# Altium project ammdk_shield.PrjPcb
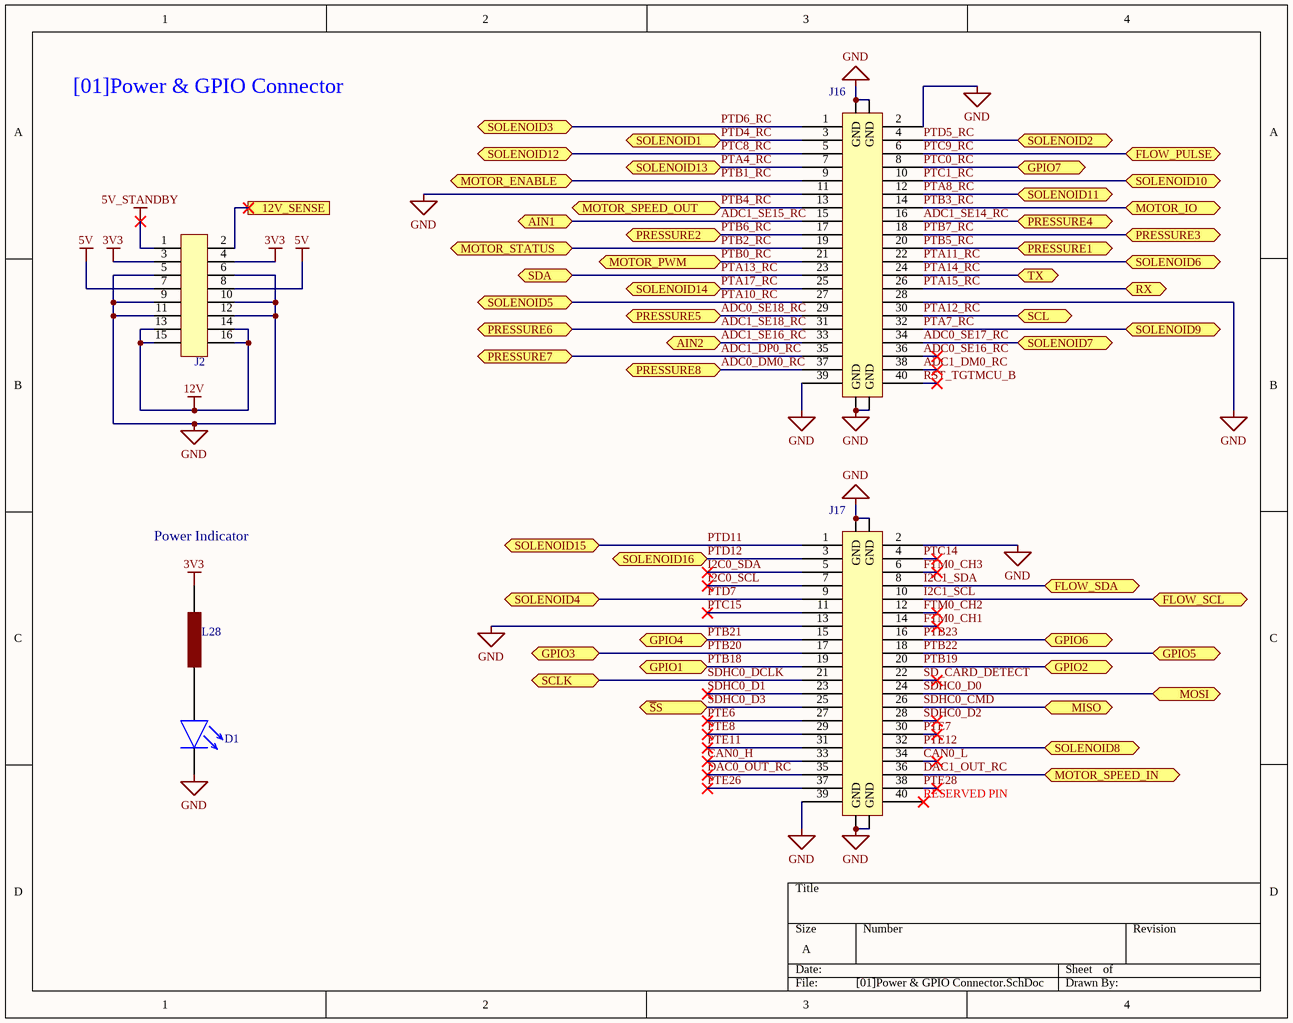
[diagram p0: [01]Power & GPIO Connector.SchDoc]
5 sheets, 112 parts. Net scope: flat (ports and power ports of the same name join across sheets).
Board files: blank_application_board.PcbDoc, generic_shield.PcbDoc
Sheets:
  [01]Power & GPIO Connector.SchDoc
  [02]Solenoid Driver.SchDoc
  [03]Pressure and Flow.SchDoc
  [04]Misc IO.SchDoc
  [05]Motor.SchDoc

## Sheet [01]Power & GPIO Connector.SchDoc
size A

### Parts
D1  XZFBB45S-9  [PLCC-2]  (value not drawn)
J2  DF11-16DP-2DSA(01)  [DF11-16DP-2DSA(01)_FLIP]  (value not drawn)
J16  M55-7004042R  [M55-7004042R_FLIP]  (value not drawn)
J17  M55-7004042R  [M55-7004042R_FLIP]  (value not drawn)
L28  MH2029-300Y  [INDC2012X11N]  (value not drawn)

### Ports
12V_SENSE, AIN1 (bidir), AIN2 (bidir), FLOW_PULSE (bidir), FLOW_SCL (bidir), FLOW_SDA (bidir), GPIO1 (bidir), GPIO2 (bidir), GPIO3 (bidir), GPIO4 (bidir), GPIO5 (bidir), GPIO6 (bidir), GPIO7 (bidir), MISO (bidir), MOSI (bidir), MOTOR_ENABLE (bidir), MOTOR_IO (bidir), MOTOR_PWM (bidir), MOTOR_SPEED_IN (bidir), MOTOR_SPEED_OUT (bidir), MOTOR_STATUS (bidir), PRESSURE1 (bidir), PRESSURE2 (bidir), PRESSURE3 (bidir), PRESSURE4 (bidir), PRESSURE5 (bidir), PRESSURE6 (bidir), PRESSURE7 (bidir), PRESSURE8 (bidir), RX (bidir), SCL (bidir), SCLK (bidir), SDA (bidir), SOLENOID1 (bidir), SOLENOID2 (bidir), SOLENOID3 (bidir), SOLENOID4 (bidir), SOLENOID5 (bidir), SOLENOID6 (bidir), SOLENOID7 (bidir), SOLENOID8 (bidir), SOLENOID9 (bidir), SOLENOID10 (bidir), SOLENOID11 (bidir), SOLENOID12 (bidir), SOLENOID13 (bidir), SOLENOID14 (bidir), SOLENOID15 (bidir), SOLENOID16 (bidir), TX (bidir), ~{S}S (bidir)

### Nets
3V3: J2.3 J2.4 L28.2
5V: J2.7 J2.8
5V_STANDBY: J2.1
12V: J2.13 J2.14 J2.15 J2.16
GND: D1.2 J2.5 J2.6 J2.9 J2.10 J2.11 J2.12 J16.2 J16.11 J16.28 J16.39 J16.GND J17.2 J17.13 J17.39 J17.GND
ADC0_DM0_RC: J16.37 ; port PRESSURE8
ADC0_SE16_RC: J16.36
ADC0_SE17_RC: J16.34 ; port SOLENOID7
ADC0_SE18_RC: J16.29 ; port PRESSURE5
ADC1_DM0_RC: J16.38
ADC1_DP0_RC: J16.35 ; port PRESSURE7
ADC1_SE14_RC: J16.16 ; port PRESSURE4
ADC1_SE15_RC: J16.15 ; port AIN1
ADC1_SE16_RC: J16.33 ; port AIN2
ADC1_SE18_RC: J16.31 ; port PRESSURE6
CAN0_H: J17.33
CAN0_L: J17.34
DAC0_OUT_RC: J17.35
DAC1_OUT_RC: J17.36 ; port MOTOR_SPEED_IN
FTM0_CH1: J17.14
FTM0_CH2: J17.12
FTM0_CH3: J17.6
I2C0_SCL: J17.7
I2C0_SDA: J17.5
I2C1_SCL: J17.10 ; port FLOW_SCL
I2C1_SDA: J17.8 ; port FLOW_SDA
PTA4_RC: J16.7 ; port SOLENOID13
PTA7_RC: J16.32 ; port SOLENOID9
PTA8_RC: J16.12 ; port SOLENOID11
PTA10_RC: J16.27 ; port SOLENOID5
PTA11_RC: J16.22 ; port SOLENOID6
PTA12_RC: J16.30 ; port SCL
PTA13_RC: J16.23 ; port SDA
PTA14_RC: J16.24 ; port TX
PTA15_RC: J16.26 ; port RX
PTA17_RC: J16.25 ; port SOLENOID14
PTB0_RC: J16.21 ; port MOTOR_PWM
PTB1_RC: J16.9 ; port MOTOR_ENABLE
PTB2_RC: J16.19 ; port MOTOR_STATUS
PTB3_RC: J16.14 ; port MOTOR_IO
PTB4_RC: J16.13 ; port MOTOR_SPEED_OUT
PTB5_RC: J16.20 ; port PRESSURE1
PTB6_RC: J16.17 ; port PRESSURE2
PTB7_RC: J16.18 ; port PRESSURE3
PTB18: J17.19 ; port GPIO1
PTB19: J17.20 ; port GPIO2
PTB20: J17.17 ; port GPIO3
PTB21: J17.15 ; port GPIO4
PTB22: J17.18 ; port GPIO5
PTB23: J17.16 ; port GPIO6
PTC0_RC: J16.8 ; port GPIO7
PTC1_RC: J16.10 ; port SOLENOID10
PTC8_RC: J16.5 ; port SOLENOID12
PTC9_RC: J16.6 ; port FLOW_PULSE
PTC14: J17.4
PTC15: J17.11
PTD4_RC: J16.3 ; port SOLENOID1
PTD5_RC: J16.4 ; port SOLENOID2
PTD6_RC: J16.1 ; port SOLENOID3
PTD7: J17.9 ; port SOLENOID4
PTD11: J17.1 ; port SOLENOID15
PTD12: J17.3 ; port SOLENOID16
PTE6: J17.27
PTE7: J17.30
PTE8: J17.29
PTE11: J17.31
PTE12: J17.32 ; port SOLENOID8
PTE26: J17.37
PTE28: J17.38
RST_TGTMCU_B: J16.40
SD_CARD_DETECT: J17.22
SDHC0_CMD: J17.26 ; port MISO
SDHC0_D0: J17.24 ; port MOSI
SDHC0_D1: J17.23
SDHC0_D2: J17.28
SDHC0_D3: J17.25 ; port ~{S}S
SDHC0_DCLK: J17.21 ; port SCLK
NetD1_1: D1.1 L28.1
NetJ2_2: J2.2 ; port 12V_SENSE

Not connected (* = marked no-connect by the designer): J17 40*

### Notes on the sheet
- [01]Power & GPIO Connector
- Power Indicator
- (near J17) RESERVED PIN

### Library data of the parts
D1 = XZFBB45S-9: LED BLUE CLEAR 2PLCC SMD; Manufacturer: SunLED; Configuration: Standard; Lens Color: Colorless; Millicandela Rating: 447mcd; Lens Style: Round with Flat Top; Lens Size: 2.40mm Dia; Voltage - Forward (Vf) (Typ): 3.3V; Current - Test: 20mA; Viewing Angle: 120°; Wavelength - Dominant: 470nm; Wavelength - Peak: 465nm; Supplier 1: Digi-Key; Manufacturer Part Number: XZFBB45S-9; RoHS: RoHS Compliant; Category: Optoelectronics; Stock 1: 5275; Pricing 1: 1=0.83, 10=0.651, 25=0.5456, 100=0.4752, 250=0.4224, 500=0.3696, 1000=0.2992 (USD); Packaging: Cut Tape (CT); Part Status: Active; Color: Blue; Lens Transparency: Clear; Mounting Type: Surface Mount, Bottom Entry; Features: -; Package / Case: 2-SMD, Z-Bend; Supplier Device Package: 2-PLCC; Size / Dimension: 3.20mm L x 2.80mm W; Height (Max): 1.90mm; ComponentLink1URL: http://www.sunledusa.com/products/spec/XZFBB45S-9.pdf; ComponentLink1Description: http://www.sunledusa.com/products/spec/XZFBB45S-9.pdf; Supplier Part Number 1: 1497-1233-1-ND
J2 = DF11-16DP-2DSA(01): Headers & Wire Housings 2MM V PCB HEADER 16P DR THRU-HOLE GLD; Manufacturer: Hirose Connector; Current Rating: 2 A; Mounting Angle: Vertical; Number of Positions: 16 Position; Voltage Rating: 250 V; Supplier 1: Digi-Key; Manufacturer Part Number: DF11-16DP-2DSA(01); RoHS: RoHS Compliant; Category: Headers & Wire Housings; Contact Plating: Gold; Number of Rows: 2 Row; Packaging: Bulk; Product: Headers; Series: DF11; Termination Style: Through Hole; Type: Shrouded; Brand: Hirose Connector; Contact Material: Brass; Mounting Style: -; Pitch: 2 mm; Standard Pack Qty: 100; RoHS - Mouser: Y; Minimum Order Quantity: 1; Reeling: False; ComponentLink1URL: http://www.mouser.com/datasheet/2/185/DF11_catalog-939040.pdf; ComponentLink1Description: http://www.mouser.com/datasheet/2/185/DF11_catalog-939040.pdf; Supplier Part Number 1: H2856-ND
J16 J17 = M55-7004042R: Board to Board & Mezzanine Connectors 40P 1.27 SMC Male; Manufacturer: Harwin; Current Rating: 1.2 A; Mounting Angle: Straight; Number of Positions: 40 Position; Voltage Rating: 100 V; Pitch: 1.27 mm; Insulation Resistance: 10 GOhms; Stack Height: 6.75 mm; Product Status: New Product; Supplier 1: Digi-Key; Manufacturer Part Number: M55-7004042R; RoHS: RoHS Compliant; Category: Board to Board & Mezzanine Connectors; Contact Plating: Gold; Housing Material: Liquid Crystal Polymer (LCP); Number of Rows: 2 Row; Packaging: Cut Tape; Product: Headers; Termination Style: SMD/SMT; Brand: Harwin; Contact Material: Phosphor Bronze; Flammability Rating: UL 94 V-0; Mounting Style: Mounting Peg; Maximum Operating Temperature: + 125 C; Minimum Operating Temperature: - 55 C; Standard Pack Qty: 500; Termination Post Length: 4 mm; Tradename: Archer Kontrol; RoHS - Mouser: Y; Minimum Order Quantity: 1; Reeling: True; ComponentLink1URL: http://www.mouser.com/datasheet/2/181/M55-70X-1286676.pdf; ComponentLink1Description: http://www.mouser.com/datasheet/2/181/M55-70X-1286676.pdf; Supplier Part Number 1: 952-3871-1-ND
L28 = MH2029-300Y: EMI Filter Beads, Chips & Arrays Impedance 30ohms IDC 3.0; Manufacturer: Bourns; Maximum DC Current: 3 A; Maximum DC Resistance: 25 mOhms; Tolerance: 25 %; Type: High Current Chip Ferrite Bead; Test Frequency: 100 MHz; Filter Type: Power, Signal Line; Number of Lines: 1; Impedance @ Frequency: 30 Ohm @ 100MHz; Current Rating (Max): 3A; DC Resistance (DCR) (Max): 25 mOhm; Manufacturer Part Number: MH2029-300Y; RoHS: RoHS Compliant; Category: EMI Filter Beads, Chips & Arrays; Pricing 1: 1=0.1, 10=0.062, 25=0.0568, 50=0.051, 100=0.0375, 250=0.02724, 500=0.02498, 1000=0.02157 (USD); Capacitance: -; Height: 0.9 mm; Impedance: 30 Ohms; Length: 2 mm; Operating Temperature Range: - 55 C to + 125 C; Package / Case: 0805 (2012 metric); Packaging: Reel; Product: Ferrite Chip Beads; Termination Style: SMD/SMT; Width: 1.2 mm; Brand: Bourns; Product Category: SMD Ferrite Bead; Standard Pack Qty: 4000; RoHS - Mouser: Y; Minimum Order Quantity: 1; Reeling: True; ComponentLink1URL: http://www.mouser.com/ds/2/54/h-777565.pdf; ComponentLink1Description: http://www.mouser.com/ds/2/54/h-777565.pdf; Supplier 1: Digi-Key; Stock 1: 62738; Ratings: -; Operating Temperature: -55°C ~ 125°C; Mounting Type: Surface Mount; Height (Max): 0.043" (1.10mm); Size / Dimension: 0.079" L x 0.047" W (2.00mm x 1.20mm); ComponentLink2URL: http://www.bourns.com/docs/Product-Datasheets/mh.pdf; ComponentLink2Description: http://www.bourns.com/docs/Product-Datasheets/mh.pdf; Supplier Part Number 1: MH2029-300YCT-ND

## Sheet [02]Solenoid Driver.SchDoc
size A3
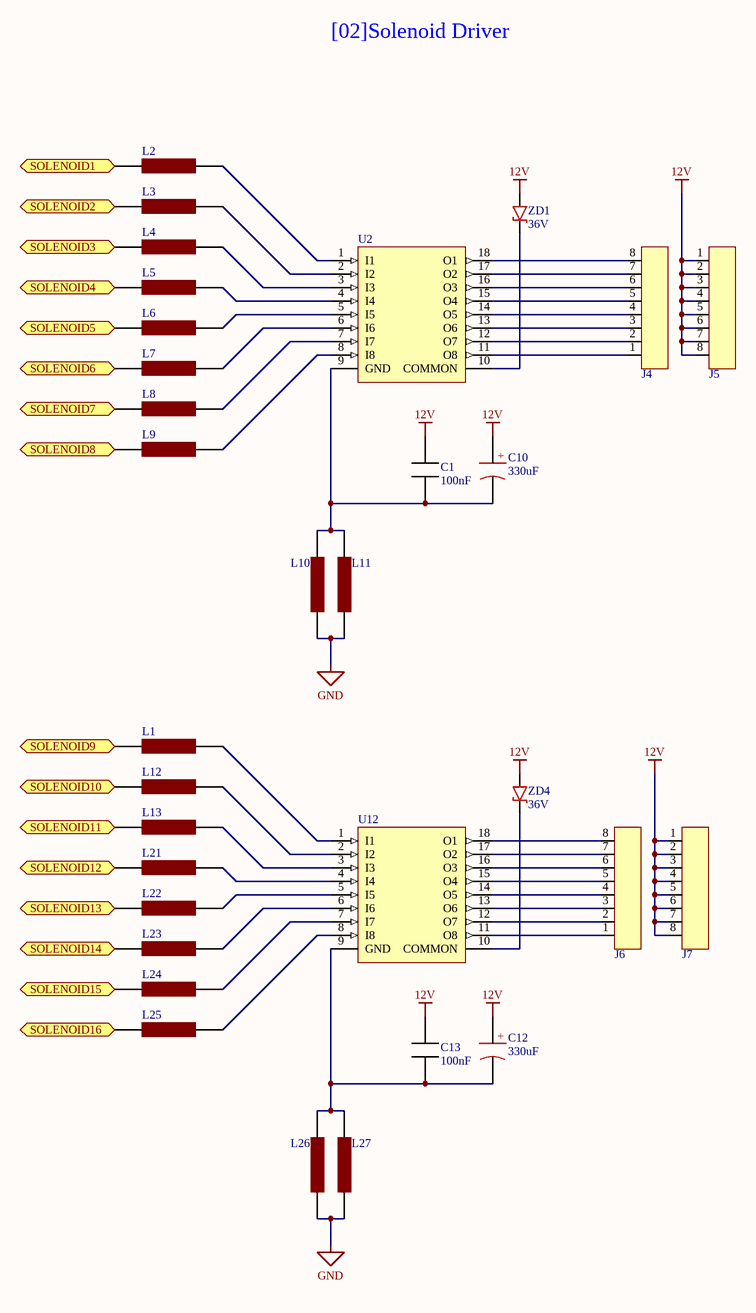
[diagram p1: [02]Solenoid Driver.SchDoc]

### Parts
C1  100nF  [CAPC2012X09N]
C10  330uF  [CAPAE137130X140M]
C12  330uF  [CAPAE137130X140M]
C13  100nF  [CAPC2012X09N]
J4  1771156  [1771156]  (value not drawn)
J5  1771156  [1771156]  (value not drawn)
J6  1771156  [1771156]  (value not drawn)
J7  1771156  [1771156]  (value not drawn)
L1  MH2029-300Y  [INDC2012X11N]  (value not drawn)
L2  MH2029-300Y  [INDC2012X11N]  (value not drawn)
L3  MH2029-300Y  [INDC2012X11N]  (value not drawn)
L4  MH2029-300Y  [INDC2012X11N]  (value not drawn)
L5  MH2029-300Y  [INDC2012X11N]  (value not drawn)
L6  MH2029-300Y  [INDC2012X11N]  (value not drawn)
L7  MH2029-300Y  [INDC2012X11N]  (value not drawn)
L8  MH2029-300Y  [INDC2012X11N]  (value not drawn)
L9  MH2029-300Y  [INDC2012X11N]  (value not drawn)
L10  MH2029-300Y  [INDC2012X11N]  (value not drawn)
L11  MH2029-300Y  [INDC2012X11N]  (value not drawn)
L12  MH2029-300Y  [INDC2012X11N]  (value not drawn)
L13  MH2029-300Y  [INDC2012X11N]  (value not drawn)
L21  MH2029-300Y  [INDC2012X11N]  (value not drawn)
L22  MH2029-300Y  [INDC2012X11N]  (value not drawn)
L23  MH2029-300Y  [INDC2012X11N]  (value not drawn)
L24  MH2029-300Y  [INDC2012X11N]  (value not drawn)
L25  MH2029-300Y  [INDC2012X11N]  (value not drawn)
L26  MH2029-300Y  [INDC2012X11N]  (value not drawn)
L27  MH2029-300Y  [INDC2012X11N]  (value not drawn)
U2  TBD62083A  [TSOP65P640X155-18N]  (value not drawn)
U12  TBD62083A  [TSOP65P640X155-18N]  (value not drawn)
ZD1  36V  [SOT95P237X111-3N]
ZD4  36V  [SOT95P237X111-3N]

### Ports
SOLENOID1 (bidir), SOLENOID2 (bidir), SOLENOID3 (bidir), SOLENOID4 (bidir), SOLENOID5 (bidir), SOLENOID6 (bidir), SOLENOID7 (bidir), SOLENOID8 (bidir), SOLENOID9 (bidir), SOLENOID10 (bidir), SOLENOID11 (bidir), SOLENOID12 (bidir), SOLENOID13 (bidir), SOLENOID14 (bidir), SOLENOID15 (bidir), SOLENOID16 (bidir)

### Nets
12V: C1.2 C10.1 C12.1 C13.2 J5.1 J5.2 J5.3 J5.4 J5.5 J5.6 J5.7 J5.8 J7.1 J7.2 J7.3 J7.4 J7.5 J7.6 J7.7 J7.8 ZD1.A ZD4.A
GND: L10.1 L11.1 L26.1 L27.1
ADC0_SE17_RC: L8.1 ; port SOLENOID7
PTA4_RC: L22.1 ; port SOLENOID13
PTA7_RC: L1.1 ; port SOLENOID9
PTA8_RC: L13.1 ; port SOLENOID11
PTA10_RC: L6.1 ; port SOLENOID5
PTA11_RC: L7.1 ; port SOLENOID6
PTA17_RC: L23.1 ; port SOLENOID14
PTC1_RC: L12.1 ; port SOLENOID10
PTC8_RC: L21.1 ; port SOLENOID12
PTD4_RC: L2.1 ; port SOLENOID1
PTD5_RC: L3.1 ; port SOLENOID2
PTD6_RC: L4.1 ; port SOLENOID3
PTD7: L5.1 ; port SOLENOID4
PTD11: L24.1 ; port SOLENOID15
PTD12: L25.1 ; port SOLENOID16
PTE12: L9.1 ; port SOLENOID8
NetC1_1: C1.1 C10.2 L10.2 L11.2 U2.9(GND)
NetC12_2: C12.2 C13.1 L26.2 L27.2 U12.9(GND)
NetJ4_1: J4.1 U2.11(O8)
NetJ4_2: J4.2 U2.12(O7)
NetJ4_3: J4.3 U2.13(O6)
NetJ4_4: J4.4 U2.14(O5)
NetJ4_5: J4.5 U2.15(O4)
NetJ4_6: J4.6 U2.16(O3)
NetJ4_7: J4.7 U2.17(O2)
NetJ4_8: J4.8 U2.18(O1)
NetJ6_1: J6.1 U12.11(O8)
NetJ6_2: J6.2 U12.12(O7)
NetJ6_3: J6.3 U12.13(O6)
NetJ6_4: J6.4 U12.14(O5)
NetJ6_5: J6.5 U12.15(O4)
NetJ6_6: J6.6 U12.16(O3)
NetJ6_7: J6.7 U12.17(O2)
NetJ6_8: J6.8 U12.18(O1)
NetL1_2: L1.2 U12.1(I1)
NetL2_2: L2.2 U2.1(I1)
NetL3_2: L3.2 U2.2(I2)
NetL4_2: L4.2 U2.3(I3)
NetL5_2: L5.2 U2.4(I4)
NetL6_2: L6.2 U2.5(I5)
NetL7_2: L7.2 U2.6(I6)
NetL8_2: L8.2 U2.7(I7)
NetL9_2: L9.2 U2.8(I8)
NetL12_2: L12.2 U12.2(I2)
NetL13_2: L13.2 U12.3(I3)
NetL21_2: L21.2 U12.4(I4)
NetL22_2: L22.2 U12.5(I5)
NetL23_2: L23.2 U12.6(I6)
NetL24_2: L24.2 U12.7(I7)
NetL25_2: L25.2 U12.8(I8)
NetU2_10: U2.10(COMMON) ZD1.K
NetU12_10: U12.10(COMMON) ZD4.K

### Notes on the sheet
- [02]Solenoid Driver
- (in symbol EMVH350ARA331MKE0S) +

### Library data of the parts
C1 C13 = CL21F104ZBCNNNC: CAP CER 0.1UF 50V Y5V 0805; Manufacturer: Samsung Electro-Mechanics America, Inc.; Capacitance: 0.10µF; Tolerance: -20%, +80%; Temperature Coefficient: Y5V (F); Supplier 1: Digi-Key; Manufacturer Part Number: CL21F104ZBCNNNC; RoHS: RoHS Compliant; Category: Capacitors; Stock 1: 1030146; Pricing 1: 1=0.1, 10=0.031, 25=0.022, 50=0.017, 100=0.0144, 500=0.01004, 1000=0.00783 (USD); Packaging: Cut Tape (CT); Voltage - Rated: 50V; Mounting Type: Surface Mount, MLCC; Operating Temperature: -30°C ~ 85°C; Applications: General Purpose; Ratings: -; Package / Case: 0805 (2012 Metric); Size / Dimension: 0.079" L x 0.049" W (2.00mm x 1.25mm); Height - Seated (Max): -; Thickness (Max): 0.037" (0.95mm); Lead Spacing: -; Features: -; Lead Style: -; ComponentLink1URL: http://www.samsungsem.com/kr/support/product-search/mlcc/CL21F104ZBCNNNC.jsp; ComponentLink1Description: http://www.samsungsem.com/kr/support/product-search/mlcc/CL21F104ZBCNNNC.jsp; Supplier Part Number 1: 1276-1007-1-ND
C10 C12 = EMVH350ARA331MKE0S: CAP ALUM 330UF 20% 35V SMD; Supplier 1: Digi-Key; Supplier Part Number 1: 565-2316-1-ND
J4-J7 = 1771156: CONN TERM BLK 8POS 2.5MM SMD; Manufacturer: Phoenix Contact; Positions Per Level: 8; Pitch: 0.098" (2.50mm); Mating Orientation: Vertical with Board; Wire Gauge: 20-26 AWG; Wire Termination: Screwless - Spring Cage, Tension Clamp; Supplier 1: Digi-Key; Manufacturer Part Number: 1771156; RoHS: RoHS Compliant; Category: Connectors, Interconnects; Stock 1: 2856; Pricing 1: 1=1.39, 10=1.334, 50=1.276, 100=1.2412 (USD); Packaging: Cut Tape (CT); Part Status: Active; Mounting Type: Surface Mount; Features: Solder Retention; Color: Black; Operating Temperature: -; Housing Material: Liquid Crystal Polymer (LCP); Contact Material - Plating: -; Clamp Material - Plating: -; Screw Material - Plating: -; Torque - Screw: -; Screw Thread: -; ComponentLink1URL: https://media.digikey.com/pdf/Data%20Sheets/Phoenix%20Contact%20PDFs/1771156.pdf; ComponentLink1Description: https://media.digikey.com/pdf/Data%20Sheets/Phoenix%20Contact%20PDFs/1771156.pdf; Supplier Part Number 1: 277-2078-1-ND
L1-L13 L21-L27 = MH2029-300Y: as L28 on sheet [01]Power & GPIO Connector; Manufacturer Part Number: MH2029-300Y; RoHS: RoHS Compliant; Category: EMI Filter Beads, Chips & Arrays; Pricing 1: 1=0.1, 10=0.062, 25=0.0568, 50=0.051, 100=0.0375, 250=0.02724, 500=0.02498, 1000=0.02157 (USD); Capacitance: -; Height: 0.9 mm; Impedance: 30 Ohms; Length: 2 mm; Operating Temperature Range: - 55 C to + 125 C; Package / Case: 0805 (2012 metric); Packaging: Reel; Product: Ferrite Chip Beads; Termination Style: SMD/SMT; Width: 1.2 mm; Brand: Bourns; Product Category: SMD Ferrite Bead; Standard Pack Qty: 4000; RoHS - Mouser: Y; Minimum Order Quantity: 1; Reeling: True; ComponentLink1URL: http://www.mouser.com/ds/2/54/h-777565.pdf; ComponentLink1Description: http://www.mouser.com/ds/2/54/h-777565.pdf; Supplier 1: Digi-Key; Stock 1: 62738; Ratings: -; Operating Temperature: -55°C ~ 125°C; Mounting Type: Surface Mount; Height (Max): 0.043" (1.10mm); Size / Dimension: 0.079" L x 0.047" W (2.00mm x 1.20mm); ComponentLink2URL: http://www.bourns.com/docs/Product-Datasheets/mh.pdf; ComponentLink2Description: http://www.bourns.com/docs/Product-Datasheets/mh.pdf; Supplier Part Number 1: MH2029-300YCT-ND
U2 U12 = TBD62083A: 8channel source type DMOS transistor array; Supplier 1: Digi-Key; Supplier Part Number 1: TBD62083AFNGELCT-ND
ZD1 ZD4 = BZX84C36LT1G: Zener Diode 36V 225mW ±6%; pin to pad: A>1 K>3; Supplier 1: Digi-Key; Supplier Part Number 1: BZX84C36LT1GOSCT-ND

## Sheet [03]Pressure and Flow.SchDoc
size A3
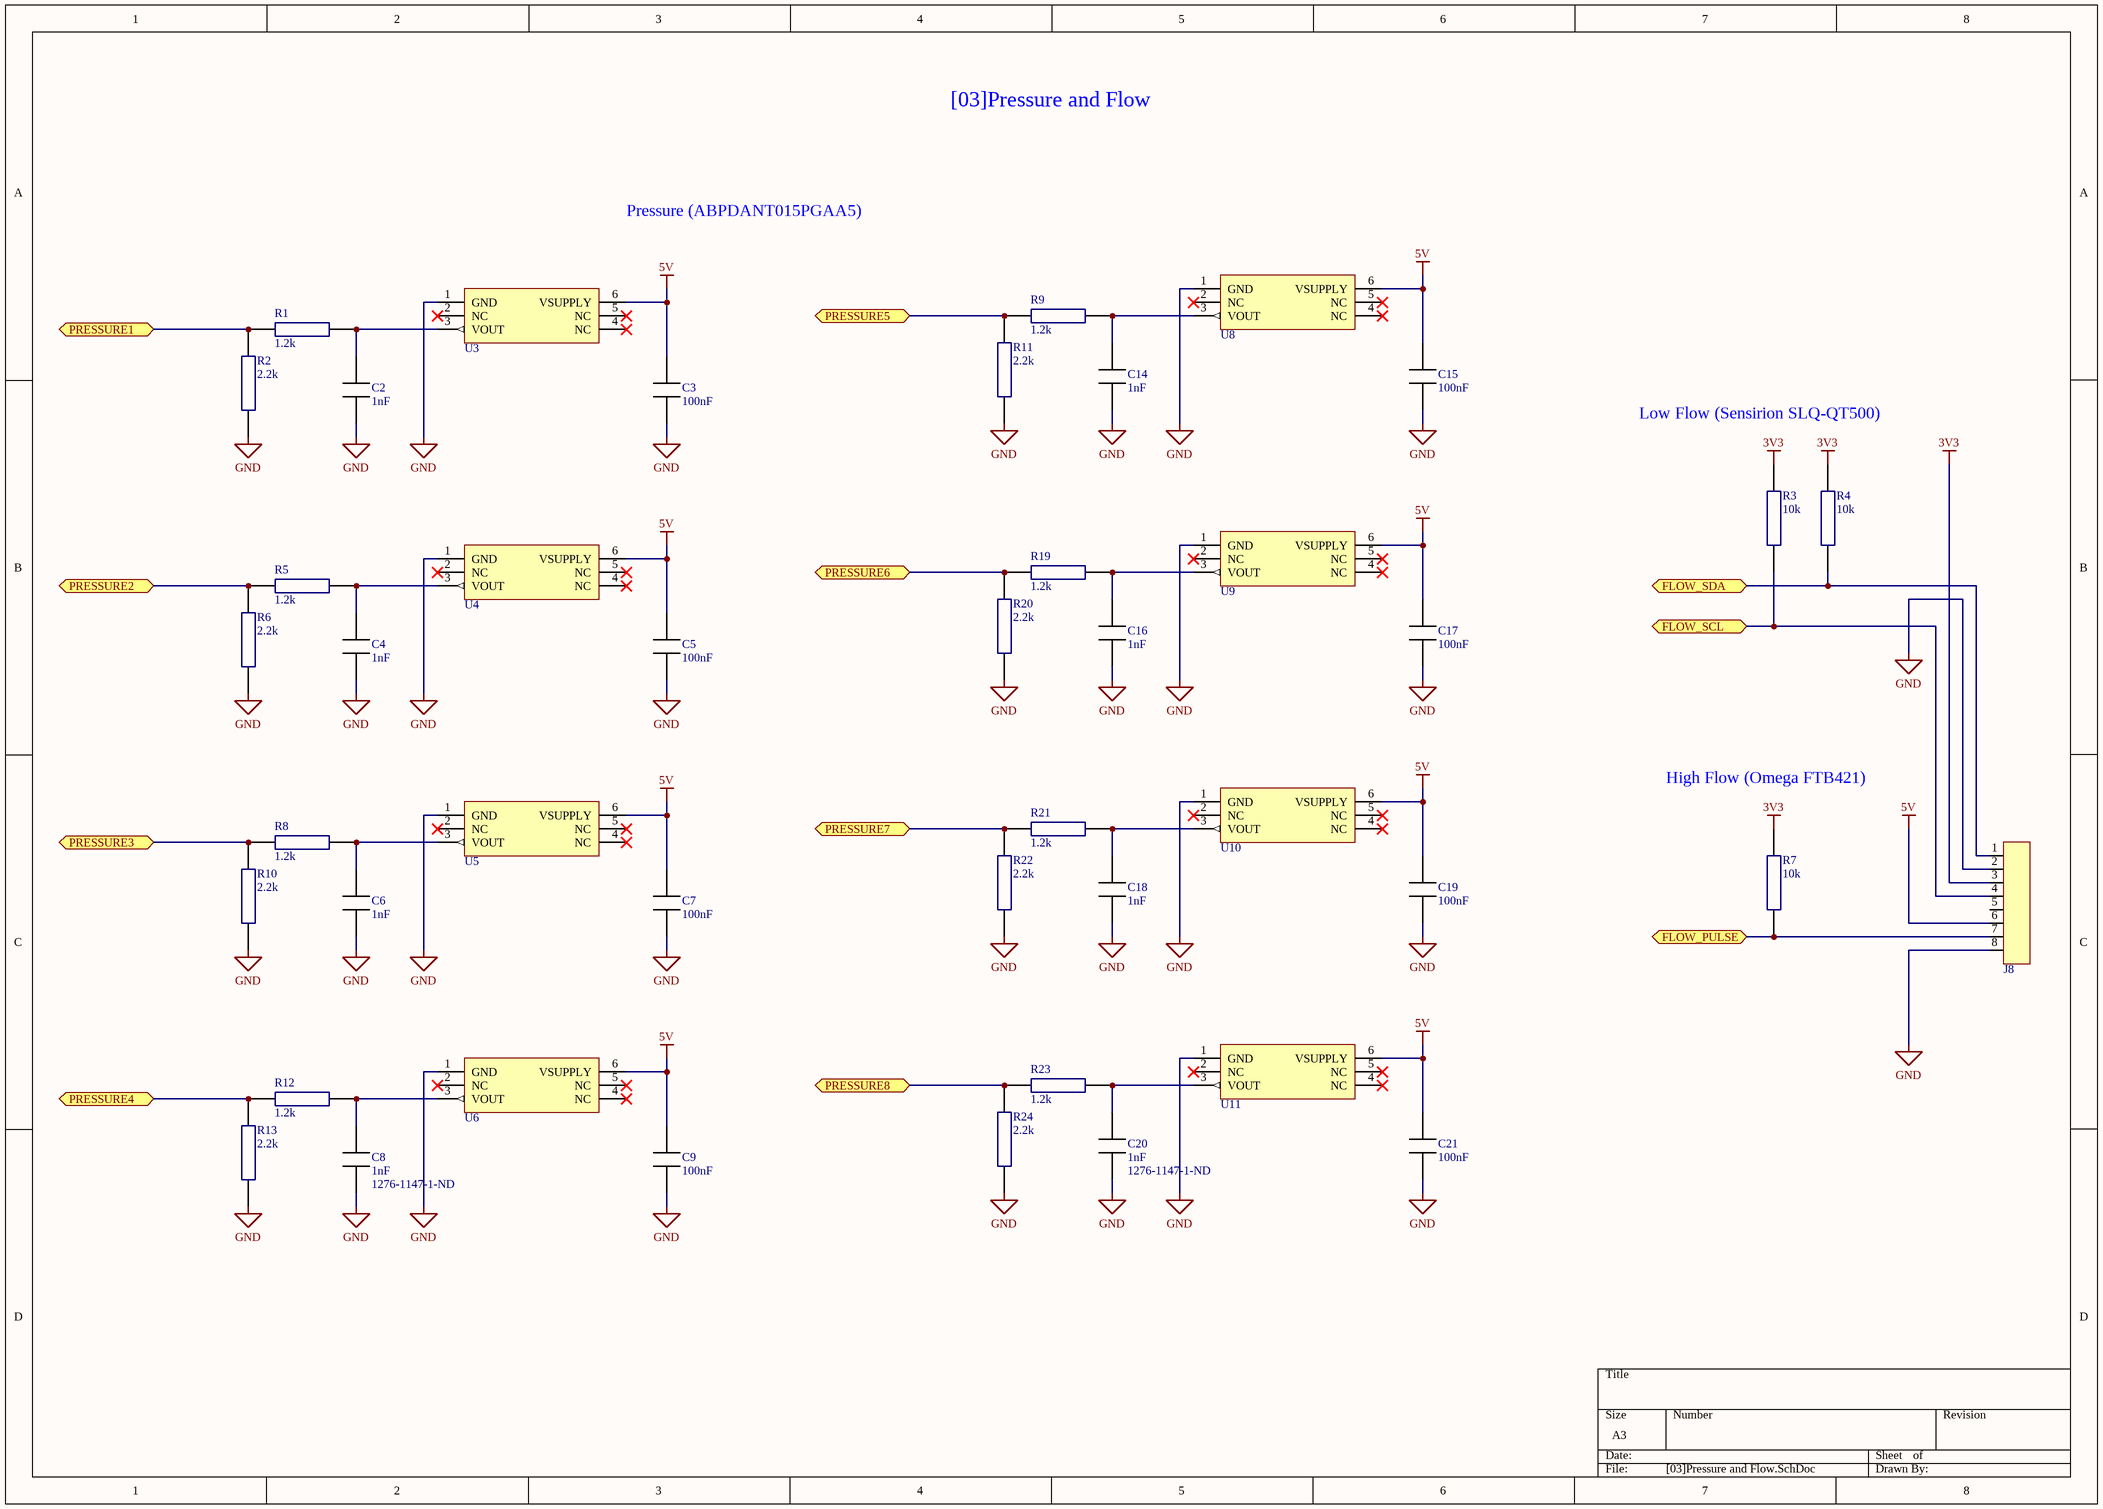
[diagram p2: [03]Pressure and Flow.SchDoc]

### Parts
C2  1nF  [CAPC2012X09N]
C3  100nF  [CAPC2012X09N]
C4  1nF  [CAPC2012X09N]
C5  100nF  [CAPC2012X09N]
C6  1nF  [CAPC2012X09N]
C7  100nF  [CAPC2012X09N]
C8  1nF  Supplier Part Number 1: 1276-1147-1-ND  [CAPC2012X09N]
C9  100nF  [CAPC2012X09N]
C14  1nF  [CAPC2012X09N]
C15  100nF  [CAPC2012X09N]
C16  1nF  [CAPC2012X09N]
C17  100nF  [CAPC2012X09N]
C18  1nF  [CAPC2012X09N]
C19  100nF  [CAPC2012X09N]
C20  1nF  Supplier Part Number 1: 1276-1147-1-ND  [CAPC2012X09N]
C21  100nF  [CAPC2012X09N]
J8  1771156  [1771156]  (value not drawn)
R1  1.2k  [RESC2012X07N_SAMSUNG]
R2  2.2k  [RESC2012X07N_SAMSUNG]
R3  10k  [RESC2012X07N_SAMSUNG]
R4  10k  [RESC2012X07N_SAMSUNG]
R5  1.2k  [RESC2012X07N_SAMSUNG]
R6  2.2k  [RESC2012X07N_SAMSUNG]
R7  10k  [RESC2012X07N_SAMSUNG]
R8  1.2k  [RESC2012X07N_SAMSUNG]
R9  1.2k  [RESC2012X07N_SAMSUNG]
R10  2.2k  [RESC2012X07N_SAMSUNG]
R11  2.2k  [RESC2012X07N_SAMSUNG]
R12  1.2k  [RESC2012X07N_SAMSUNG]
R13  2.2k  [RESC2012X07N_SAMSUNG]
R19  1.2k  [RESC2012X07N_SAMSUNG]
R20  2.2k  [RESC2012X07N_SAMSUNG]
R21  1.2k  [RESC2012X07N_SAMSUNG]
R22  2.2k  [RESC2012X07N_SAMSUNG]
R23  1.2k  [RESC2012X07N_SAMSUNG]
R24  2.2k  [RESC2012X07N_SAMSUNG]
U3  ABPDANT015PGAA5_SMD  [DIP6 SMD]  (value not drawn)
U4  ABPDANT015PGAA5_SMD  [DIP6 SMD]  (value not drawn)
U5  ABPDANT015PGAA5_SMD  [DIP6 SMD]  (value not drawn)
U6  ABPDANT015PGAA5_SMD  [DIP6 SMD]  (value not drawn)
U8  ABPDANT015PGAA5_SMD  [DIP6 SMD]  (value not drawn)
U9  ABPDANT015PGAA5_SMD  [DIP6 SMD]  (value not drawn)
U10  ABPDANT015PGAA5_SMD  [DIP6 SMD]  (value not drawn)
U11  ABPDANT015PGAA5_SMD  [DIP6 SMD]  (value not drawn)

### Ports
FLOW_PULSE (bidir), FLOW_SCL (bidir), FLOW_SDA (bidir), PRESSURE1 (bidir), PRESSURE2 (bidir), PRESSURE3 (bidir), PRESSURE4 (bidir), PRESSURE5 (bidir), PRESSURE6 (bidir), PRESSURE7 (bidir), PRESSURE8 (bidir)

### Nets
3V3: J8.3 R3.2 R4.2 R7.2
5V: C3.2 C5.2 C7.2 C9.2 C15.2 C17.2 C19.2 C21.2 J8.6 U3.6(VSUPPLY) U4.6(VSUPPLY) U5.6(VSUPPLY) U6.6(VSUPPLY) U8.6(VSUPPLY) U9.6(VSUPPLY) U10.6(VSUPPLY) U11.6(VSUPPLY)
GND: C2.1 C3.1 C4.1 C5.1 C6.1 C7.1 C8.1 C9.1 C14.1 C15.1 C16.1 C17.1 C18.1 C19.1 C20.1 C21.1 J8.2 J8.8 R2.1 R6.1 R10.1 R11.1 R13.1 R20.1 R22.1 R24.1 U3.1(GND) U4.1(GND) U5.1(GND) U6.1(GND) U8.1(GND) U9.1(GND) U10.1(GND) U11.1(GND)
ADC0_DM0_RC: R23.1 R24.2 ; port PRESSURE8
ADC0_SE18_RC: R9.1 R11.2 ; port PRESSURE5
ADC1_DP0_RC: R21.1 R22.2 ; port PRESSURE7
ADC1_SE14_RC: R12.1 R13.2 ; port PRESSURE4
ADC1_SE18_RC: R19.1 R20.2 ; port PRESSURE6
I2C1_SCL: J8.4 R3.1 ; port FLOW_SCL
I2C1_SDA: J8.1 R4.1 ; port FLOW_SDA
PTB5_RC: R1.1 R2.2 ; port PRESSURE1
PTB6_RC: R5.1 R6.2 ; port PRESSURE2
PTB7_RC: R8.1 R10.2 ; port PRESSURE3
PTC9_RC: J8.7 R7.1 ; port FLOW_PULSE
NetC2_2: C2.2 R1.2 U3.3(VOUT)
NetC4_2: C4.2 R5.2 U4.3(VOUT)
NetC6_2: C6.2 R8.2 U5.3(VOUT)
NetC8_2: C8.2 R12.2 U6.3(VOUT)
NetC14_2: C14.2 R9.2 U8.3(VOUT)
NetC16_2: C16.2 R19.2 U9.3(VOUT)
NetC18_2: C18.2 R21.2 U10.3(VOUT)
NetC20_2: C20.2 R23.2 U11.3(VOUT)

Not connected (* = marked no-connect by the designer): J8 5; U3 2(NC)* 4(NC)* 5(NC)*; U4 2(NC)* 4(NC)* 5(NC)*; U5 2(NC)* 4(NC)* 5(NC)*; U6 2(NC)* 4(NC)* 5(NC)*; U8 2(NC)* 4(NC)* 5(NC)*; U9 2(NC)* 4(NC)* 5(NC)*; U10 2(NC)* 4(NC)* 5(NC)*; U11 2(NC)* 4(NC)* 5(NC)*

### Notes on the sheet
- [03]Pressure and Flow
- Pressure (ABPDANT015PGAA5)
- Low Flow (Sensirion SLQ-QT500)
- High Flow (Omega FTB421)

### Library data of the parts
C2 C4 C6 C8 C14 C16 C18 C20 = CL21C102JBCNNNC: CAP CER 1nF 50V C0G/NP0 0805; Manufacturer: Samsung Electro-Mechanics America, Inc.; Manufacturer Part Number: CL21F104ZBCNNNC; Capacitance: 0.10µF; Tolerance: -20%, +80%; Temperature Coefficient: Y5V (F); RoHS: RoHS Compliant; Category: Capacitors; Packaging: Cut Tape (CT); Voltage - Rated: 50V; Mounting Type: Surface Mount, MLCC; Operating Temperature: -30°C ~ 85°C; Applications: General Purpose; Ratings: -; Package / Case: 0805 (2012 Metric); Size / Dimension: 0.079" L x 0.049" W (2.00mm x 1.25mm); Height - Seated (Max): -; Thickness (Max): 0.037" (0.95mm); Lead Spacing: -; Features: -; Lead Style: -; ComponentLink1URL: http://www.samsungsem.com/kr/support/product-search/mlcc/CL21F104ZBCNNNC.jsp; ComponentLink1Description: http://www.samsungsem.com/kr/support/product-search/mlcc/CL21F104ZBCNNNC.jsp; Supplier 1: Digi-Key
  C2 C4 C6 C14 C16 C18: Supplier Part Number 1: 1276-1147-1-ND
C3 C5 C7 C9 C15 C17 C19 C21 = CL21F104ZBCNNNC: as C1 on sheet [02]Solenoid Driver; Supplier 1: Digi-Key; Manufacturer Part Number: CL21F104ZBCNNNC; RoHS: RoHS Compliant; Category: Capacitors; Stock 1: 1030146; Pricing 1: 1=0.1, 10=0.031, 25=0.022, 50=0.017, 100=0.0144, 500=0.01004, 1000=0.00783 (USD); Packaging: Cut Tape (CT); Voltage - Rated: 50V; Mounting Type: Surface Mount, MLCC; Operating Temperature: -30°C ~ 85°C; Applications: General Purpose; Ratings: -; Package / Case: 0805 (2012 Metric); Size / Dimension: 0.079" L x 0.049" W (2.00mm x 1.25mm); Height - Seated (Max): -; Thickness (Max): 0.037" (0.95mm); Lead Spacing: -; Features: -; Lead Style: -; ComponentLink1URL: http://www.samsungsem.com/kr/support/product-search/mlcc/CL21F104ZBCNNNC.jsp; ComponentLink1Description: http://www.samsungsem.com/kr/support/product-search/mlcc/CL21F104ZBCNNNC.jsp; Supplier Part Number 1: 1276-1007-1-ND
J8 = 1771156: as J4 on sheet [02]Solenoid Driver; Supplier 1: Digi-Key; Manufacturer Part Number: 1771156; RoHS: RoHS Compliant; Category: Connectors, Interconnects; Stock 1: 2856; Pricing 1: 1=1.39, 10=1.334, 50=1.276, 100=1.2412 (USD); Packaging: Cut Tape (CT); Part Status: Active; Mounting Type: Surface Mount; Features: Solder Retention; Color: Black; Operating Temperature: -; Housing Material: Liquid Crystal Polymer (LCP); Contact Material - Plating: -; Clamp Material - Plating: -; Screw Material - Plating: -; Torque - Screw: -; Screw Thread: -; ComponentLink1URL: https://media.digikey.com/pdf/Data%20Sheets/Phoenix%20Contact%20PDFs/1771156.pdf; ComponentLink1Description: https://media.digikey.com/pdf/Data%20Sheets/Phoenix%20Contact%20PDFs/1771156.pdf; Supplier Part Number 1: 277-2078-1-ND
R1 R5 R8 R9 R12 R19 R21 R23 = RC2012F122CS: RES SMD 1.2K OHM 1% 1/8W 0805; Manufacturer: Samsung Electro-Mechanics America, Inc.; Manufacturer Part Number: RC2012F103CS; Resistance (Ohms): 10k; Power (Watts): 0.125W, 1/8W; Temperature Coefficient: ±100ppm/°C; RoHS: RoHS Compliant; Category: Resistors; Packaging: Cut Tape (CT); Tolerance: ±1%; Composition: Thick Film; Features: Moisture Resistant; Operating Temperature: -55°C ~ 155°C; Package / Case: 0805 (2012 Metric); Supplier Device Package: 0805 (2012 Metric); Size / Dimension: 0.079" L x 0.049" W (2.00mm x 1.25mm); Height: 0.024" (0.60mm); Number of Terminations: 2; ComponentLink1URL: http://media.digikey.com/pdf/Data%20Sheets/Samsung%20PDFs/RC_Series_ds.pdf; ComponentLink1Description: http://media.digikey.com/pdf/Data%20Sheets/Samsung%20PDFs/RC_Series_ds.pdf; Supplier 1: Digi-Key; Supplier Part Number 1: 1276-5275-1-ND
R2 R6 R10 R11 R13 R20 R22 R24 = RC2012F222CS: RES SMD 2.2K OHM 1% 1/8W 0805; Manufacturer: Samsung Electro-Mechanics America, Inc.; Manufacturer Part Number: RC2012F103CS; Resistance (Ohms): 10k; Power (Watts): 0.125W, 1/8W; Temperature Coefficient: ±100ppm/°C; RoHS: RoHS Compliant; Category: Resistors; Packaging: Cut Tape (CT); Tolerance: ±1%; Composition: Thick Film; Features: Moisture Resistant; Operating Temperature: -55°C ~ 155°C; Package / Case: 0805 (2012 Metric); Supplier Device Package: 0805 (2012 Metric); Size / Dimension: 0.079" L x 0.049" W (2.00mm x 1.25mm); Height: 0.024" (0.60mm); Number of Terminations: 2; ComponentLink1URL: http://media.digikey.com/pdf/Data%20Sheets/Samsung%20PDFs/RC_Series_ds.pdf; ComponentLink1Description: http://media.digikey.com/pdf/Data%20Sheets/Samsung%20PDFs/RC_Series_ds.pdf; Supplier 1: Digi-Key; Supplier Part Number 1: 1276-5290-1-ND
R3 R4 R7 = RC2012F103CS: RES SMD 10K OHM 1% 1/8W 0805; Manufacturer: Samsung Electro-Mechanics America, Inc.; Power (Watts): 0.125W, 1/8W; Temperature Coefficient: ±100ppm/°C; Manufacturer Part Number: RC2012F103CS; RoHS: RoHS Compliant; Category: Resistors; Packaging: Cut Tape (CT); Resistance (Ohms): 10k; Tolerance: ±1%; Composition: Thick Film; Features: Moisture Resistant; Operating Temperature: -55°C ~ 155°C; Package / Case: 0805 (2012 Metric); Supplier Device Package: 0805 (2012 Metric); Size / Dimension: 0.079" L x 0.049" W (2.00mm x 1.25mm); Height: 0.024" (0.60mm); Number of Terminations: 2; ComponentLink1URL: http://media.digikey.com/pdf/Data%20Sheets/Samsung%20PDFs/RC_Series_ds.pdf; ComponentLink1Description: http://media.digikey.com/pdf/Data%20Sheets/Samsung%20PDFs/RC_Series_ds.pdf; Supplier 1: Digi-Key; Supplier Part Number 1: 1276-5332-1-ND
U3-U6 U8-U11 = ABPDANT015PGAA5_SMD: Pressure Sensor 15 PSIG; Supplier 1: Digi-Key; Supplier Part Number 1: 480-6253-ND; Supplier 2: Digi-Key; Supplier Part Number 2: SAM1148-03-ND

## Sheet [04]Misc IO.SchDoc
size A
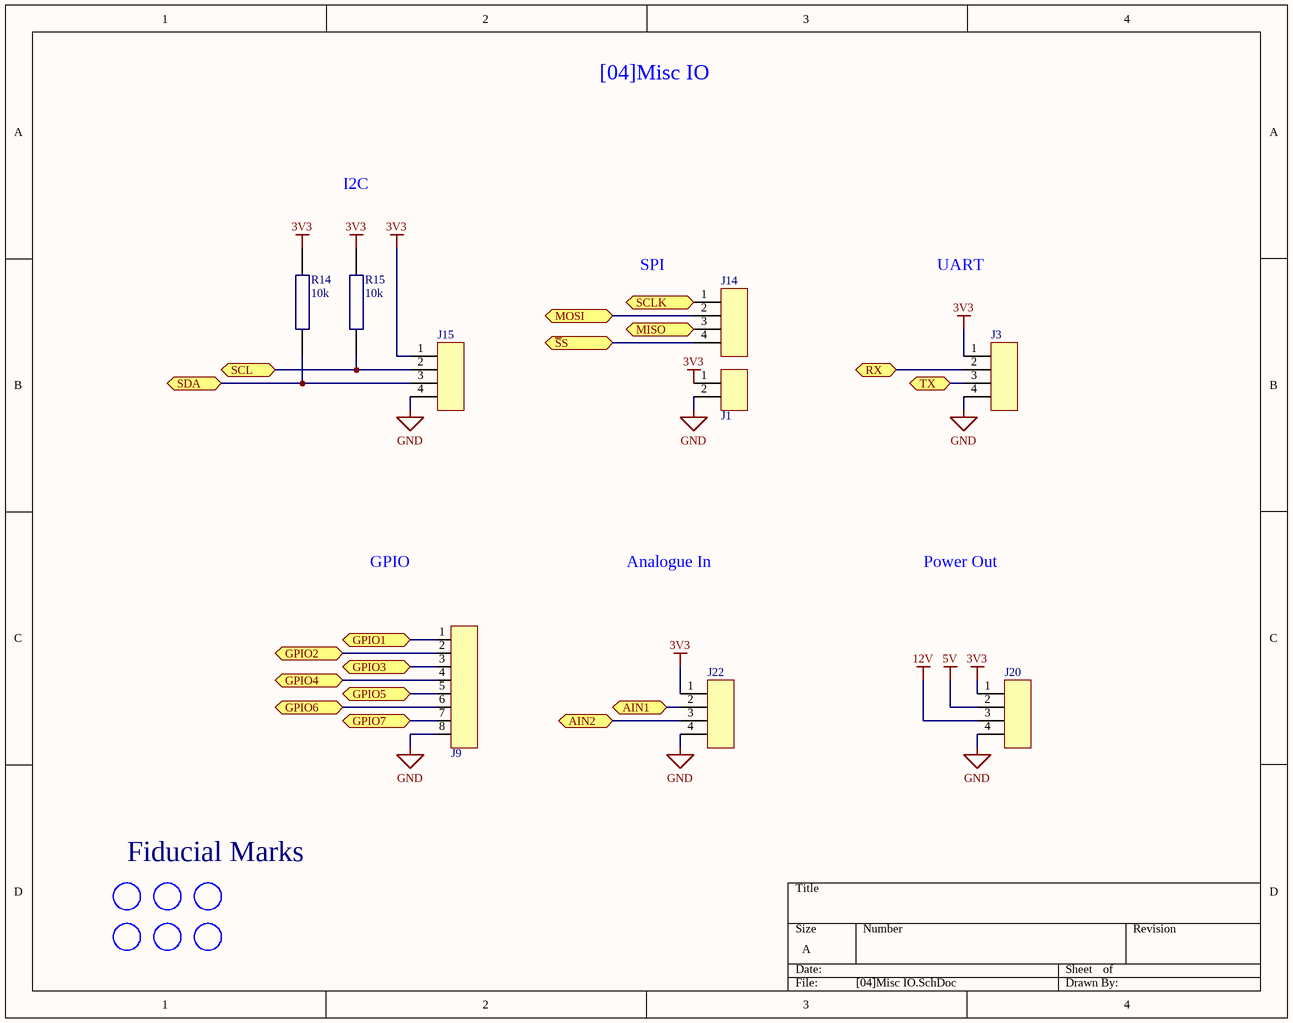
[diagram p3: [04]Misc IO.SchDoc]

### Parts
FID1  FID?  [fiducial]  (value not drawn)
FID2  FID?  [fiducial]  (value not drawn)
FID3  FID?  [fiducial]  (value not drawn)
FID4  FID?  [fiducial]  (value not drawn)
FID5  FID?  [fiducial]  (value not drawn)
FID6  FID?  [fiducial]  (value not drawn)
J1  282834-2  [282834-2]  (value not drawn)
J3  282834-4  [282834-4]  (value not drawn)
J9  1771156  [1771156]  (value not drawn)
J14  282834-4  [282834-4]  (value not drawn)
J15  282834-4  [282834-4]  (value not drawn)
J20  282834-4  [282834-4]  (value not drawn)
J22  282834-4  [282834-4]  (value not drawn)
R14  10k  [RESC2012X07N_SAMSUNG]
R15  10k  [RESC2012X07N_SAMSUNG]

### Ports
AIN1 (bidir), AIN2 (bidir), GPIO1 (bidir), GPIO2 (bidir), GPIO3 (bidir), GPIO4 (bidir), GPIO5 (bidir), GPIO6 (bidir), GPIO7 (bidir), MISO (bidir), MOSI (bidir), RX (bidir), SCL (bidir), SCLK (bidir), SDA (bidir), TX (bidir), ~{S}S (bidir)

### Nets
3V3: J1.1 J3.1 J15.1 J20.1 J22.1 R14.2 R15.2
5V: J20.2
12V: J20.3
GND: J1.2 J3.4 J9.8 J15.4 J20.4 J22.4
ADC1_SE15_RC: J22.2 ; port AIN1
ADC1_SE16_RC: J22.3 ; port AIN2
PTA12_RC: J15.2 R15.1 ; port SCL
PTA13_RC: J15.3 R14.1 ; port SDA
PTA14_RC: J3.3 ; port TX
PTA15_RC: J3.2 ; port RX
PTB18: J9.1 ; port GPIO1
PTB19: J9.2 ; port GPIO2
PTB20: J9.3 ; port GPIO3
PTB21: J9.4 ; port GPIO4
PTB22: J9.5 ; port GPIO5
PTB23: J9.6 ; port GPIO6
PTC0_RC: J9.7 ; port GPIO7
SDHC0_CMD: J14.3 ; port MISO
SDHC0_D0: J14.2 ; port MOSI
SDHC0_D3: J14.4 ; port ~{S}S
SDHC0_DCLK: J14.1 ; port SCLK

### Notes on the sheet
- [04]Misc IO
- I2C
- SPI
- UART
- GPIO
- Analogue In
- Power Out
- Fiducial Marks

### Library data of the parts
FID1-FID6 = fiducial
J1 = 282834-2: 2 Position Wire to Board Terminal Block; Supplier 1: Digi-Key; Supplier Part Number 1: A98333-ND
J3 J14 J15 J20 J22 = 282834-4: 4 Position Wire to Board Terminal Block; Supplier 1: Digi-Key; Supplier Part Number 1: A98335-ND
J9 = 1771156: as J4 on sheet [02]Solenoid Driver; Supplier 1: Digi-Key; Manufacturer Part Number: 1771156; RoHS: RoHS Compliant; Category: Connectors, Interconnects; Stock 1: 2856; Pricing 1: 1=1.39, 10=1.334, 50=1.276, 100=1.2412 (USD); Packaging: Cut Tape (CT); Part Status: Active; Mounting Type: Surface Mount; Features: Solder Retention; Color: Black; Operating Temperature: -; Housing Material: Liquid Crystal Polymer (LCP); Contact Material - Plating: -; Clamp Material - Plating: -; Screw Material - Plating: -; Torque - Screw: -; Screw Thread: -; ComponentLink1URL: https://media.digikey.com/pdf/Data%20Sheets/Phoenix%20Contact%20PDFs/1771156.pdf; ComponentLink1Description: https://media.digikey.com/pdf/Data%20Sheets/Phoenix%20Contact%20PDFs/1771156.pdf; Supplier Part Number 1: 277-2078-1-ND
R14 R15 = RC2012F103CS: as R3 on sheet [03]Pressure and Flow; Manufacturer Part Number: RC2012F103CS; RoHS: RoHS Compliant; Category: Resistors; Packaging: Cut Tape (CT); Resistance (Ohms): 10k; Tolerance: ±1%; Composition: Thick Film; Features: Moisture Resistant; Operating Temperature: -55°C ~ 155°C; Package / Case: 0805 (2012 Metric); Supplier Device Package: 0805 (2012 Metric); Size / Dimension: 0.079" L x 0.049" W (2.00mm x 1.25mm); Height: 0.024" (0.60mm); Number of Terminations: 2; ComponentLink1URL: http://media.digikey.com/pdf/Data%20Sheets/Samsung%20PDFs/RC_Series_ds.pdf; ComponentLink1Description: http://media.digikey.com/pdf/Data%20Sheets/Samsung%20PDFs/RC_Series_ds.pdf; Supplier 1: Digi-Key; Supplier Part Number 1: 1276-5332-1-ND

## Sheet [05]Motor.SchDoc
size A
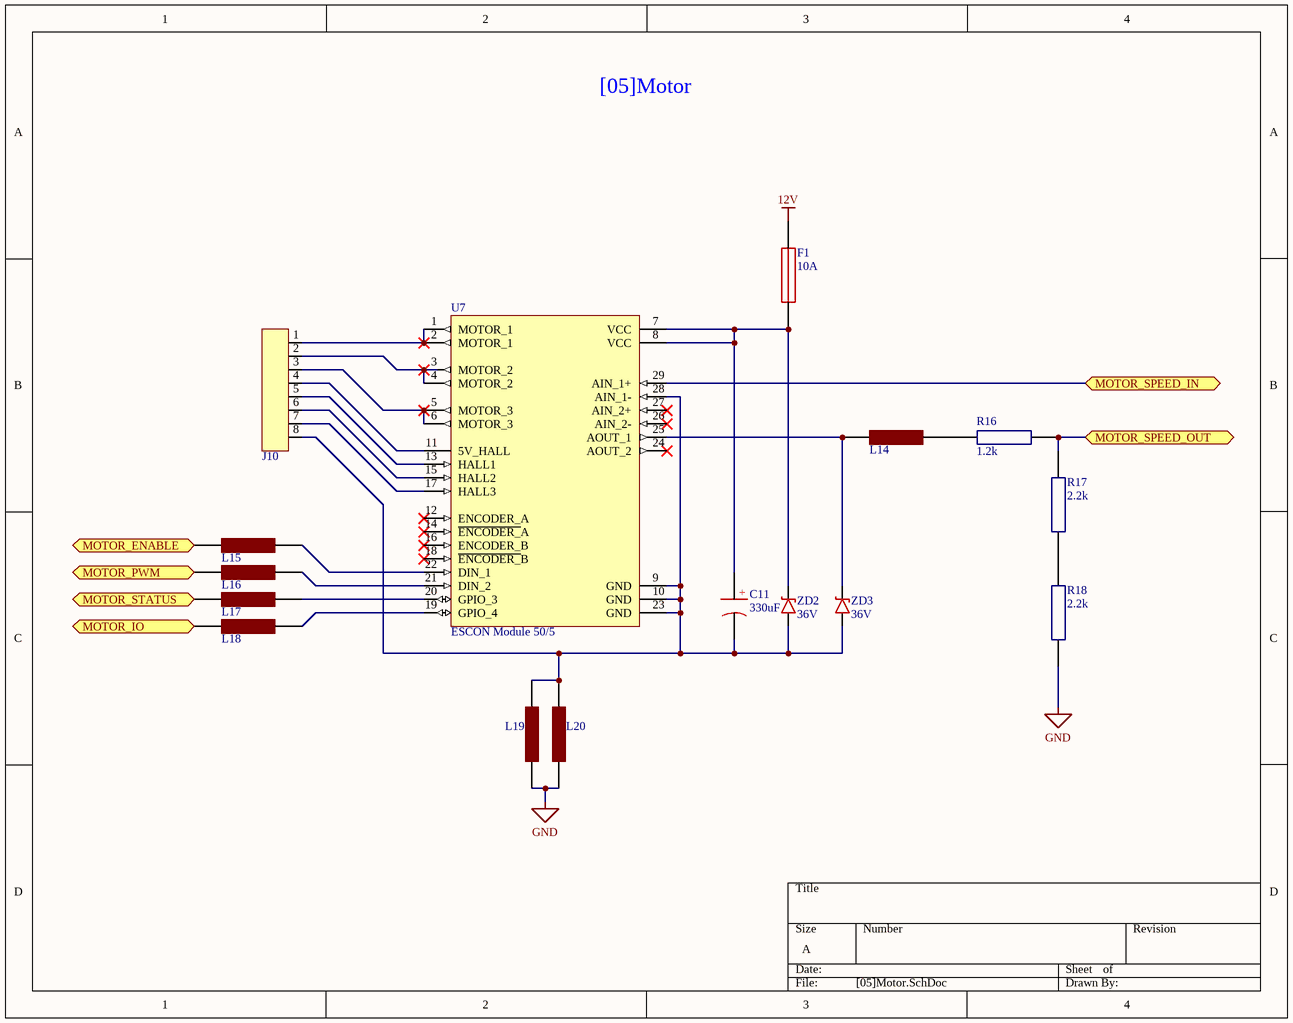
[diagram p4: [05]Motor.SchDoc]

### Parts
C11  330uF  [CAPAE137130X140M]
F1  10A  [0157004.DR]
J10  1771156  [1771156]  (value not drawn)
L14  MH2029-300Y  [INDC2012X11N]  (value not drawn)
L15  MH2029-300Y  [INDC2012X11N]  (value not drawn)
L16  MH2029-300Y  [INDC2012X11N]  (value not drawn)
L17  MH2029-300Y  [INDC2012X11N]  (value not drawn)
L18  MH2029-300Y  [INDC2012X11N]  (value not drawn)
L19  MH2029-300Y  [INDC2012X11N]  (value not drawn)
L20  MH2029-300Y  [INDC2012X11N]  (value not drawn)
R16  1.2k  [RESC2012X07N_SAMSUNG]
R17  2.2k  [RESC2012X07N_SAMSUNG]
R18  2.2k  [RESC2012X07N_SAMSUNG]
U7  ESCON Module 50/5  [ESCON Module 50/5 SMD]
ZD2  36V  [SOT95P237X111-3N]
ZD3  36V  [SOT95P237X111-3N]

### Ports
MOTOR_ENABLE (bidir), MOTOR_IO (bidir), MOTOR_PWM (bidir), MOTOR_SPEED_IN (bidir), MOTOR_SPEED_OUT (bidir), MOTOR_STATUS (bidir)

### Nets
12V: F1.2
GND: L19.2 L20.1 R18.1
DAC1_OUT_RC: U7.29(AIN_1+) ; port MOTOR_SPEED_IN
PTB0_RC: L16.1 ; port MOTOR_PWM
PTB1_RC: L15.1 ; port MOTOR_ENABLE
PTB2_RC: L17.1 ; port MOTOR_STATUS
PTB3_RC: L18.1 ; port MOTOR_IO
PTB4_RC: R16.1 R17.2 ; port MOTOR_SPEED_OUT
NetC11_1: C11.1 F1.1 U7.7(VCC) U7.8(VCC) ZD2.K
NetC11_2: C11.2 J10.8 L19.1 L20.2 U7.9(GND) U7.10(GND) U7.23(GND) U7.28(AIN_1-) ZD2.A ZD3.A
NetJ10_1: J10.1 U7.1(MOTOR_1) U7.2(MOTOR_1)
NetJ10_2: J10.2 U7.3(MOTOR_2) U7.4(MOTOR_2)
NetJ10_3: J10.3 U7.5(MOTOR_3) U7.6(MOTOR_3)
NetJ10_4: J10.4 U7.11(5V_HALL)
NetJ10_5: J10.5 U7.13(HALL1)
NetJ10_6: J10.6 U7.15(HALL2)
NetJ10_7: J10.7 U7.17(HALL3)
NetL14_1: L14.1 U7.25(AOUT_1) ZD3.K
NetL14_2: L14.2 R16.2
NetL15_2: L15.2 U7.22(DIN_1)
NetL16_2: L16.2 U7.21(DIN_2)
NetL17_2: L17.2 U7.20(GPIO_3)
NetL18_2: L18.2 U7.19(GPIO_4)
NetR17_1: R17.1 R18.2

Not connected (* = marked no-connect by the designer): U7 12(ENCODER_A)* 14(~{ENCODER_}A)* 16(ENCODER_B)* 18(~{ENCODER_}B)* 24(AOUT_2)* 26(AIN_2-)* 27(AIN_2+)*

### Notes on the sheet
- [05]Motor
- (in symbol EMVH350ARA331MKE0S) +

### Library data of the parts
C11 = EMVH350ARA331MKE0S: CAP ALUM 330UF 20% 35V SMD; Supplier 1: Digi-Key; Supplier Part Number 1: 565-2316-1-ND
F1 = 0157010.DR: FUSE BRD MNT 10A 125VAC/VDC SMD; Manufacturer: Littelfuse Inc.; Fuse Type: Board Mount (Cartridge Style Excluded); Response Time: Fast; Breaking Capacity @ Rated Voltage: 35A AC, 50A DC; Approvals: cULus, PSE; Supplier 1: Digi-Key; Manufacturer Part Number: 0157010.DR; RoHS: RoHS Compliant; Category: Circuit Protection; Stock 1: 6229; Pricing 1: 1=2.73, 5=2.6, 10=2.47, 50=1.9936, 100=1.6903, 250=1.64692, 500=1.38688 (USD); Packaging: Cut Tape (CT); Part Status: Active; Package / Case: 2-SMD, Square End Block with Clip; Mounting Type: Holder, Surface Mount; Operating Temperature: -55°C ~ 125°C; Color: -; Size / Dimension: 0.256" L x 0.146" W x 0.154" H (6.50mm x 3.70mm x 3.90mm); ComponentLink1URL: http://www.littelfuse.com/products/fuse-blocks-fuseholders-and-fuse-accessories/fuse-clips/~/media/electronics/datasheets/fuses/littelfuse_fuse_157_datasheet.pdf.pdf; ComponentLink1Description: http://www.littelfuse.com/products/fuse-blocks-fuseholders-and-fuse-accessories/fuse-clips/~/media/electronics/datasheets/fuses/littelfuse_fuse_157_datasheet.pdf.pdf; Supplier Part Number 1: F2973CT-ND
J10 = 1771156: as J4 on sheet [02]Solenoid Driver; Supplier 1: Digi-Key; Manufacturer Part Number: 1771156; RoHS: RoHS Compliant; Category: Connectors, Interconnects; Stock 1: 2856; Pricing 1: 1=1.39, 10=1.334, 50=1.276, 100=1.2412 (USD); Packaging: Cut Tape (CT); Part Status: Active; Mounting Type: Surface Mount; Features: Solder Retention; Color: Black; Operating Temperature: -; Housing Material: Liquid Crystal Polymer (LCP); Contact Material - Plating: -; Clamp Material - Plating: -; Screw Material - Plating: -; Torque - Screw: -; Screw Thread: -; ComponentLink1URL: https://media.digikey.com/pdf/Data%20Sheets/Phoenix%20Contact%20PDFs/1771156.pdf; ComponentLink1Description: https://media.digikey.com/pdf/Data%20Sheets/Phoenix%20Contact%20PDFs/1771156.pdf; Supplier Part Number 1: 277-2078-1-ND
L14-L20 = MH2029-300Y: as L28 on sheet [01]Power & GPIO Connector; Manufacturer Part Number: MH2029-300Y; RoHS: RoHS Compliant; Category: EMI Filter Beads, Chips & Arrays; Pricing 1: 1=0.1, 10=0.062, 25=0.0568, 50=0.051, 100=0.0375, 250=0.02724, 500=0.02498, 1000=0.02157 (USD); Capacitance: -; Height: 0.9 mm; Impedance: 30 Ohms; Length: 2 mm; Operating Temperature Range: - 55 C to + 125 C; Package / Case: 0805 (2012 metric); Packaging: Reel; Product: Ferrite Chip Beads; Termination Style: SMD/SMT; Width: 1.2 mm; Brand: Bourns; Product Category: SMD Ferrite Bead; Standard Pack Qty: 4000; RoHS - Mouser: Y; Minimum Order Quantity: 1; Reeling: True; ComponentLink1URL: http://www.mouser.com/ds/2/54/h-777565.pdf; ComponentLink1Description: http://www.mouser.com/ds/2/54/h-777565.pdf; Supplier 1: Digi-Key; Stock 1: 62738; Ratings: -; Operating Temperature: -55°C ~ 125°C; Mounting Type: Surface Mount; Height (Max): 0.043" (1.10mm); Size / Dimension: 0.079" L x 0.047" W (2.00mm x 1.20mm); ComponentLink2URL: http://www.bourns.com/docs/Product-Datasheets/mh.pdf; ComponentLink2Description: http://www.bourns.com/docs/Product-Datasheets/mh.pdf; Supplier Part Number 1: MH2029-300YCT-ND
R16 = RC2012F122CS: as R1 on sheet [03]Pressure and Flow; RoHS: RoHS Compliant; Category: Resistors; Packaging: Cut Tape (CT); Tolerance: ±1%; Composition: Thick Film; Features: Moisture Resistant; Operating Temperature: -55°C ~ 155°C; Package / Case: 0805 (2012 Metric); Supplier Device Package: 0805 (2012 Metric); Size / Dimension: 0.079" L x 0.049" W (2.00mm x 1.25mm); Height: 0.024" (0.60mm); Number of Terminations: 2; ComponentLink1URL: http://media.digikey.com/pdf/Data%20Sheets/Samsung%20PDFs/RC_Series_ds.pdf; ComponentLink1Description: http://media.digikey.com/pdf/Data%20Sheets/Samsung%20PDFs/RC_Series_ds.pdf; Supplier 1: Digi-Key; Supplier Part Number 1: 1276-5275-1-ND
R17 R18 = RC2012F222CS: as R2 on sheet [03]Pressure and Flow; RoHS: RoHS Compliant; Category: Resistors; Packaging: Cut Tape (CT); Tolerance: ±1%; Composition: Thick Film; Features: Moisture Resistant; Operating Temperature: -55°C ~ 155°C; Package / Case: 0805 (2012 Metric); Supplier Device Package: 0805 (2012 Metric); Size / Dimension: 0.079" L x 0.049" W (2.00mm x 1.25mm); Height: 0.024" (0.60mm); Number of Terminations: 2; ComponentLink1URL: http://media.digikey.com/pdf/Data%20Sheets/Samsung%20PDFs/RC_Series_ds.pdf; ComponentLink1Description: http://media.digikey.com/pdf/Data%20Sheets/Samsung%20PDFs/RC_Series_ds.pdf; Supplier 1: Digi-Key; Supplier Part Number 1: 1276-5290-1-ND
U7 = ESCON Module 50/5: 4-Q servo controller for DC/EC motors, 2/6 A, 10-50 VDC; Supplier 1: Digi-Key; Supplier 2: Digi-Key; Supplier Part Number 1: SAM1152-11-ND; Supplier Part Number 2: SAM1146-09-ND
ZD2 ZD3 = BZX84C36LT1G: Zener Diode 36V 225mW ±6%; pin to pad: A>1 K>3; Supplier 1: Digi-Key; Supplier Part Number 1: BZX84C36LT1GOSCT-ND

## Nets that join several sheets
3V3: [01]Power & GPIO Connector (J2.3 J2.4 L28.2), [03]Pressure and Flow (J8.3 R3.2 R4.2 R7.2), [04]Misc IO (7 pins)
5V: [01]Power & GPIO Connector (J2.7 J2.8), [03]Pressure and Flow (17 pins), [04]Misc IO (J20.2)
12V: [01]Power & GPIO Connector (J2.13 J2.14 J2.15 J2.16), [02]Solenoid Driver (22 pins), [04]Misc IO (J20.3), [05]Motor (F1.2)
GND: [01]Power & GPIO Connector (16 pins), [02]Solenoid Driver (L10.1 L11.1 L26.1 L27.1), [03]Pressure and Flow (34 pins), [04]Misc IO (6 pins), [05]Motor (L19.2 L20.1 R18.1)
ADC0_DM0_RC: [01]Power & GPIO Connector (J16.37), [03]Pressure and Flow (R23.1 R24.2)
ADC0_SE17_RC: [01]Power & GPIO Connector (J16.34), [02]Solenoid Driver (L8.1)
ADC0_SE18_RC: [01]Power & GPIO Connector (J16.29), [03]Pressure and Flow (R9.1 R11.2)
ADC1_DP0_RC: [01]Power & GPIO Connector (J16.35), [03]Pressure and Flow (R21.1 R22.2)
ADC1_SE14_RC: [01]Power & GPIO Connector (J16.16), [03]Pressure and Flow (R12.1 R13.2)
ADC1_SE15_RC: [01]Power & GPIO Connector (J16.15), [04]Misc IO (J22.2)
ADC1_SE16_RC: [01]Power & GPIO Connector (J16.33), [04]Misc IO (J22.3)
ADC1_SE18_RC: [01]Power & GPIO Connector (J16.31), [03]Pressure and Flow (R19.1 R20.2)
DAC1_OUT_RC: [01]Power & GPIO Connector (J17.36), [05]Motor (U7.29)
I2C1_SCL: [01]Power & GPIO Connector (J17.10), [03]Pressure and Flow (J8.4 R3.1)
I2C1_SDA: [01]Power & GPIO Connector (J17.8), [03]Pressure and Flow (J8.1 R4.1)
PTA4_RC: [01]Power & GPIO Connector (J16.7), [02]Solenoid Driver (L22.1)
PTA7_RC: [01]Power & GPIO Connector (J16.32), [02]Solenoid Driver (L1.1)
PTA8_RC: [01]Power & GPIO Connector (J16.12), [02]Solenoid Driver (L13.1)
PTA10_RC: [01]Power & GPIO Connector (J16.27), [02]Solenoid Driver (L6.1)
PTA11_RC: [01]Power & GPIO Connector (J16.22), [02]Solenoid Driver (L7.1)
PTA12_RC: [01]Power & GPIO Connector (J16.30), [04]Misc IO (J15.2 R15.1)
PTA13_RC: [01]Power & GPIO Connector (J16.23), [04]Misc IO (J15.3 R14.1)
PTA14_RC: [01]Power & GPIO Connector (J16.24), [04]Misc IO (J3.3)
PTA15_RC: [01]Power & GPIO Connector (J16.26), [04]Misc IO (J3.2)
PTA17_RC: [01]Power & GPIO Connector (J16.25), [02]Solenoid Driver (L23.1)
PTB0_RC: [01]Power & GPIO Connector (J16.21), [05]Motor (L16.1)
PTB1_RC: [01]Power & GPIO Connector (J16.9), [05]Motor (L15.1)
PTB2_RC: [01]Power & GPIO Connector (J16.19), [05]Motor (L17.1)
PTB3_RC: [01]Power & GPIO Connector (J16.14), [05]Motor (L18.1)
PTB4_RC: [01]Power & GPIO Connector (J16.13), [05]Motor (R16.1 R17.2)
PTB5_RC: [01]Power & GPIO Connector (J16.20), [03]Pressure and Flow (R1.1 R2.2)
PTB6_RC: [01]Power & GPIO Connector (J16.17), [03]Pressure and Flow (R5.1 R6.2)
PTB7_RC: [01]Power & GPIO Connector (J16.18), [03]Pressure and Flow (R8.1 R10.2)
PTB18: [01]Power & GPIO Connector (J17.19), [04]Misc IO (J9.1)
PTB19: [01]Power & GPIO Connector (J17.20), [04]Misc IO (J9.2)
PTB20: [01]Power & GPIO Connector (J17.17), [04]Misc IO (J9.3)
PTB21: [01]Power & GPIO Connector (J17.15), [04]Misc IO (J9.4)
PTB22: [01]Power & GPIO Connector (J17.18), [04]Misc IO (J9.5)
PTB23: [01]Power & GPIO Connector (J17.16), [04]Misc IO (J9.6)
PTC0_RC: [01]Power & GPIO Connector (J16.8), [04]Misc IO (J9.7)
PTC1_RC: [01]Power & GPIO Connector (J16.10), [02]Solenoid Driver (L12.1)
PTC8_RC: [01]Power & GPIO Connector (J16.5), [02]Solenoid Driver (L21.1)
PTC9_RC: [01]Power & GPIO Connector (J16.6), [03]Pressure and Flow (J8.7 R7.1)
PTD4_RC: [01]Power & GPIO Connector (J16.3), [02]Solenoid Driver (L2.1)
PTD5_RC: [01]Power & GPIO Connector (J16.4), [02]Solenoid Driver (L3.1)
PTD6_RC: [01]Power & GPIO Connector (J16.1), [02]Solenoid Driver (L4.1)
PTD7: [01]Power & GPIO Connector (J17.9), [02]Solenoid Driver (L5.1)
PTD11: [01]Power & GPIO Connector (J17.1), [02]Solenoid Driver (L24.1)
PTD12: [01]Power & GPIO Connector (J17.3), [02]Solenoid Driver (L25.1)
PTE12: [01]Power & GPIO Connector (J17.32), [02]Solenoid Driver (L9.1)
SDHC0_CMD: [01]Power & GPIO Connector (J17.26), [04]Misc IO (J14.3)
SDHC0_D0: [01]Power & GPIO Connector (J17.24), [04]Misc IO (J14.2)
SDHC0_D3: [01]Power & GPIO Connector (J17.25), [04]Misc IO (J14.4)
SDHC0_DCLK: [01]Power & GPIO Connector (J17.21), [04]Misc IO (J14.1)